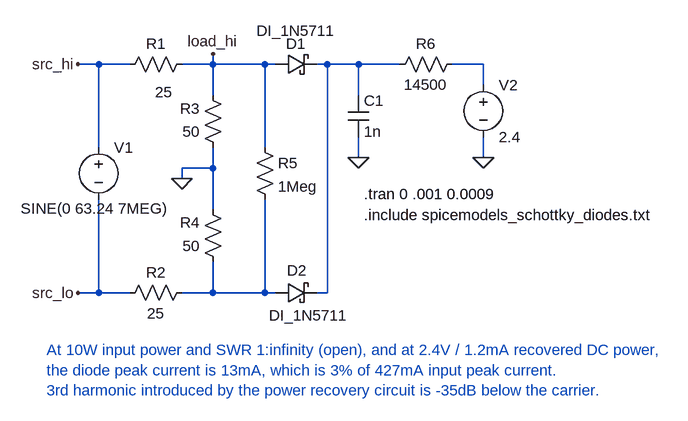
[diagram p0: schematic blinky-power-supply-10W-open.asc]
blinky-power-supply-10W-open.asc, the LTspice schematic file:
Version 4
SHEET 1 880 680
WIRE -112 112 -144 112
WIRE -64 112 -112 112
WIRE 64 112 64 96
WIRE 64 112 16 112
WIRE 144 112 64 112
WIRE 160 112 144 112
WIRE 240 112 224 112
WIRE 288 112 240 112
WIRE 352 112 288 112
WIRE 480 112 432 112
WIRE 480 144 480 112
WIRE 64 160 64 112
WIRE 288 160 288 112
WIRE -112 240 -112 112
WIRE 144 240 144 112
WIRE 288 256 288 224
WIRE 480 256 480 224
WIRE 64 272 64 240
WIRE 64 272 16 272
WIRE 16 288 16 272
WIRE 64 336 64 272
WIRE -112 464 -112 320
WIRE -112 464 -144 464
WIRE -64 464 -112 464
WIRE 64 464 64 416
WIRE 64 464 16 464
WIRE 144 464 144 320
WIRE 144 464 64 464
WIRE 160 464 144 464
WIRE 240 464 240 112
WIRE 240 464 224 464
FLAG 288 256 0
FLAG 480 256 0
FLAG 16 288 0
FLAG -144 112 src_hi
FLAG -144 464 src_lo
FLAG 64 96 load_hi
SYMBOL voltage -112 224 R0
WINDOW 3 -120 110 Left 2
WINDOW 123 24 124 Left 2
WINDOW 39 0 0 Left 0
SYMATTR Value SINE(0 63.24 7MEG)
SYMATTR InstName V1
SYMBOL res 32 96 R90
WINDOW 0 0 56 VBottom 2
WINDOW 3 43 44 VTop 2
SYMATTR InstName R1
SYMATTR Value 25
SYMBOL res 448 96 R90
WINDOW 0 0 56 VBottom 2
WINDOW 3 32 56 VTop 2
SYMATTR InstName R6
SYMATTR Value 14500
SYMBOL cap 272 160 R0
SYMATTR InstName C1
SYMATTR Value 1n
SYMBOL schottky 160 128 R270
WINDOW 0 32 32 VTop 2
WINDOW 3 83 32 VBottom 2
SYMATTR InstName D1
SYMATTR Value DI_1N5711
SYMATTR Description Diode
SYMATTR Type diode
SYMBOL voltage 480 128 R0
WINDOW 123 0 0 Left 0
WINDOW 39 0 0 Left 0
SYMATTR InstName V2
SYMATTR Value 2.4
SYMBOL res 32 448 R90
WINDOW 0 0 56 VBottom 2
WINDOW 3 32 56 VTop 2
SYMATTR InstName R2
SYMATTR Value 25
SYMBOL res 80 256 R180
WINDOW 0 36 76 Left 2
WINDOW 3 36 40 Left 2
SYMATTR InstName R3
SYMATTR Value 50
SYMBOL res 80 432 R180
WINDOW 0 36 76 Left 2
WINDOW 3 36 40 Left 2
SYMATTR InstName R4
SYMATTR Value 50
SYMBOL res 128 224 R0
SYMATTR InstName R5
SYMATTR Value 1Meg
SYMBOL schottky 160 480 R270
WINDOW 0 35 33 VTop 2
WINDOW 3 -3 51 VBottom 2
SYMATTR InstName D2
SYMATTR Value DI_1N5711
SYMATTR Description Diode
SYMATTR Type diode
TEXT 296 312 Left 2 !.tran 0 .001 0.0009
TEXT 296 344 Left 2 !.include spicemodels_schottky_diodes.txt
TEXT -192 552 Left 2 ;At 10W input power and SWR 1:infinity (open), and at 2.4V / 1.2mA recovered DC power,\nthe diode peak current is 13mA, which is 3% of 427mA input peak current.\n3rd harmonic introduced by the power recovery circuit is -35dB below the carrier.

The netlist it stands for:
* blinky-power-supply-10W-open.asc
V1 src_hi src_lo SINE(0 63.24 7MEG)
R1 load_hi src_hi 25
R6 N002 N001 14500
C1 N001 0 1n
D1 load_hi N001 DI_1N5711
V2 N002 0 2.4
R2 N003 src_lo 25
R3 0 load_hi 50
R4 N003 0 50
R5 load_hi N003 1Meg
D2 N003 N001 DI_1N5711
.model D D
.lib standard.dio
.tran 0 .001 0.0009
.include spicemodels_schottky_diodes.txt
* At 10W input power and SWR 1:infinity (open), and at 2.4V / 1.2mA recovered DC power,
* the diode peak current is 13mA, which is 3% of 427mA input peak current.
* 3rd harmonic introduced by the power recovery circuit is -35dB below the carrier.
.backanno
.end